# Altium schematic sheet PRJCTSheet1.SchDoc
size 381 x 241 mm; SheetNumber: 1; SheetTotal: 1
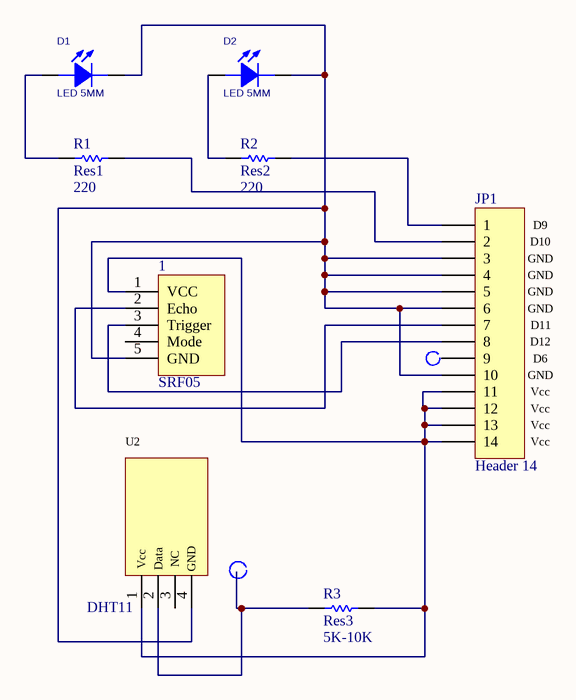
[diagram p0: PRJCTSheet1.SchDoc]

## Parts
1  SRF05  [SRF05]
D1  LED 5MM  [LED5MM_BLUE]
D2  LED 5MM  [LED5MM_BLUE]
JP1  Header 14  [HDR1X14]
R1  Res1  value 220  [AXIAL-0.3]
R2  Res2  value 220  [AXIAL-0.3]
R3  Res3  value 5K-10K  [AXIAL-0.3]
U1  DHT11  [DHT11]

## Nets
Net1_1: 1.1(VCC) JP1.11 JP1.12 JP1.13 JP1.14 R3.2 U1.1
Net1_2: 1.2(Echo) JP1.7
Net1_3: 1.3(Trigger) JP1.8
Net1_5: 1.5(GND) D1.2(CATHODE) D2.2(CATHODE) JP1.3 JP1.4 JP1.5 JP1.6 JP1.10 U1.4
NetD1_1: D1.1(ANODE) R1.1
NetD2_1: D2.1(ANODE) R2.1
NetJP1_1: JP1.1 R2.2
NetJP1_2: JP1.2 R1.2
NetR3_1: R3.1 U1.2

Not connected (* = marked no-connect by the designer): 1 4(Mode); JP1 9; U1 3

## Notes on the sheet
- (near JP1) GND
- (near JP1) D9
- (near JP1) D10
- (near JP1) D11
- (near JP1) D12
- (near JP1) D6
- (near JP1) Vcc
- (in symbol DHT11) U2; Vcc; Data; NC; GND

## Library data of the parts
1 = SRF05: SRF05 - Ultra-Sonic Ranger; Designer: Seyed Mohsen ghasemian; WEB: www.picpars.com
D1 D2 = LED 5MM: Light Emitting Diode; Designer: Abbas Basereh; Data: 16-12-2016; Link: *; Part.No: *
JP1 = Header 14: Header, 14-Pin; Revision: 17-Jul-2002: Re-released for DXP Platform.; Publisher: Altium Limited
R1-R3 = Res1: Resistor; Published: 8-Jun-2000; LatestRevisionDate: 17-Jul-2002; LatestRevisionNote: Re-released for DXP Platform.; PackageReference: AXIAL-0.3; Publisher: Altium Limited; PackageDescription: Axial Device, Thru-Hole; 2 Leads; 0.3 in Pin Spacing